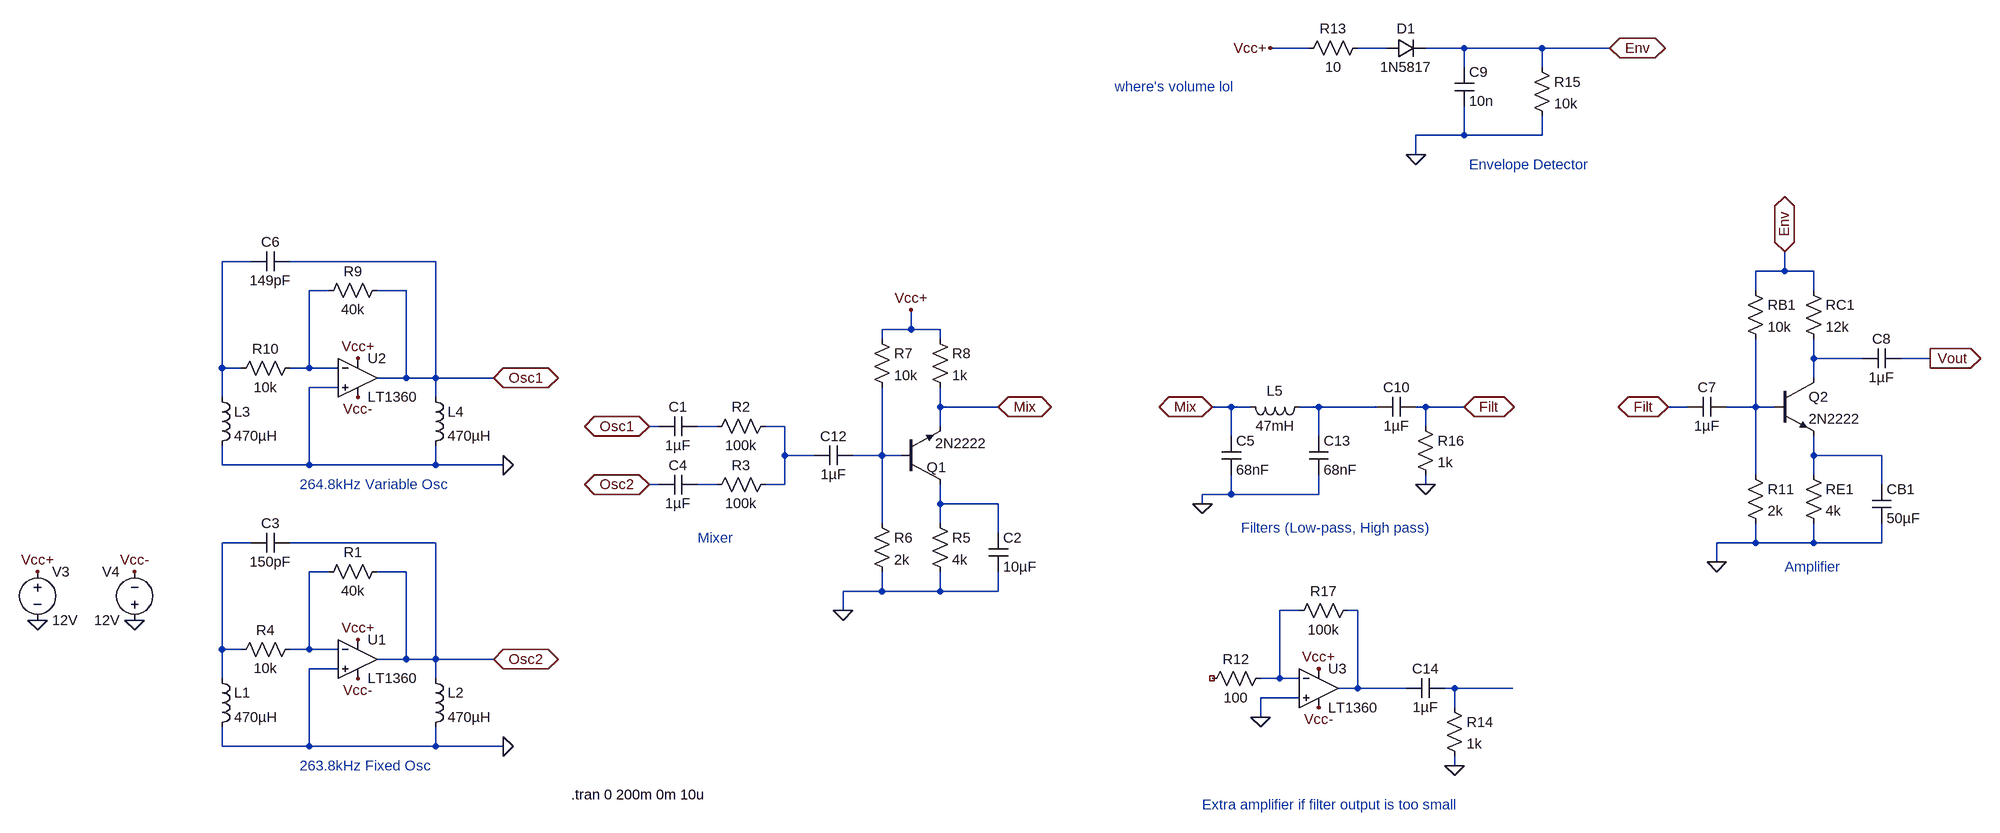
[diagram p0: schematic NoVolumeControl-V1.asc]
NoVolumeControl-V1.asc, the LTspice schematic file:
Version 4.1
SHEET 1 1940 1044
WIRE 192 -912 128 -912
WIRE 320 -912 272 -912
WIRE 448 -912 384 -912
WIRE 576 -912 448 -912
WIRE 688 -912 576 -912
WIRE 448 -880 448 -912
WIRE 576 -880 576 -912
WIRE 448 -768 448 -816
WIRE 448 -768 368 -768
WIRE 576 -768 576 -800
WIRE 576 -768 448 -768
WIRE 368 -736 368 -768
WIRE -1552 -560 -1600 -560
WIRE -1248 -560 -1488 -560
WIRE 976 -544 976 -576
WIRE 976 -544 928 -544
WIRE 1024 -544 976 -544
WIRE -1424 -512 -1456 -512
WIRE -1296 -512 -1344 -512
WIRE 928 -512 928 -544
WIRE 1024 -512 1024 -544
WIRE -464 -448 -464 -480
WIRE -464 -448 -512 -448
WIRE -416 -448 -464 -448
WIRE -512 -432 -512 -448
WIRE -416 -432 -416 -448
WIRE 1024 -400 1024 -432
WIRE 1104 -400 1024 -400
WIRE 1216 -400 1168 -400
WIRE -1600 -384 -1600 -560
WIRE -1568 -384 -1600 -384
WIRE -1456 -384 -1456 -512
WIRE -1456 -384 -1488 -384
WIRE -1408 -384 -1456 -384
WIRE -1296 -368 -1296 -512
WIRE -1296 -368 -1344 -368
WIRE -1248 -368 -1248 -560
WIRE -1248 -368 -1296 -368
WIRE -1152 -368 -1248 -368
WIRE 1024 -368 1024 -400
WIRE -1408 -352 -1456 -352
WIRE -1600 -336 -1600 -384
WIRE -1248 -336 -1248 -368
WIRE -416 -320 -416 -352
WIRE -320 -320 -416 -320
WIRE 64 -320 32 -320
WIRE 96 -320 64 -320
WIRE 208 -320 176 -320
WIRE 304 -320 208 -320
WIRE 384 -320 368 -320
WIRE 448 -320 384 -320
WIRE 816 -320 784 -320
WIRE 928 -320 928 -432
WIRE 928 -320 880 -320
WIRE 960 -320 928 -320
WIRE -880 -288 -896 -288
WIRE -784 -288 -816 -288
WIRE -672 -288 -704 -288
WIRE -416 -288 -416 -320
WIRE 384 -288 384 -320
WIRE 64 -272 64 -320
WIRE 208 -272 208 -320
WIRE -672 -240 -672 -288
WIRE -624 -240 -672 -240
WIRE -512 -240 -512 -352
WIRE -512 -240 -560 -240
WIRE -480 -240 -512 -240
WIRE 1024 -240 1024 -272
WIRE 1136 -240 1024 -240
WIRE -1600 -224 -1600 -256
WIRE -1456 -224 -1456 -352
WIRE -1456 -224 -1600 -224
WIRE -1248 -224 -1248 -256
WIRE -1248 -224 -1456 -224
WIRE -1136 -224 -1248 -224
WIRE 928 -208 928 -320
WIRE 1024 -208 1024 -240
WIRE -880 -192 -896 -192
WIRE -784 -192 -816 -192
WIRE -672 -192 -672 -240
WIRE -672 -192 -704 -192
WIRE 384 -192 384 -208
WIRE 1136 -192 1136 -240
WIRE 64 -176 64 -208
WIRE 64 -176 16 -176
WIRE 208 -176 208 -208
WIRE 208 -176 64 -176
WIRE -416 -160 -416 -192
WIRE -320 -160 -416 -160
WIRE 16 -160 16 -176
WIRE -512 -128 -512 -240
WIRE -416 -128 -416 -160
WIRE -320 -112 -320 -160
WIRE -1552 -96 -1600 -96
WIRE -1248 -96 -1488 -96
WIRE 928 -96 928 -128
WIRE 928 -96 864 -96
WIRE 1024 -96 1024 -128
WIRE 1024 -96 928 -96
WIRE 1136 -96 1136 -128
WIRE 1136 -96 1024 -96
WIRE 864 -64 864 -96
WIRE -1424 -48 -1456 -48
WIRE -1296 -48 -1344 -48
WIRE -512 -16 -512 -48
WIRE -512 -16 -576 -16
WIRE -416 -16 -416 -48
WIRE -416 -16 -512 -16
WIRE -320 -16 -320 -48
WIRE -320 -16 -416 -16
WIRE -576 16 -576 -16
WIRE 176 16 144 16
WIRE 272 16 256 16
WIRE -1600 80 -1600 -96
WIRE -1568 80 -1600 80
WIRE -1456 80 -1456 -48
WIRE -1456 80 -1488 80
WIRE -1408 80 -1456 80
WIRE -1296 96 -1296 -48
WIRE -1296 96 -1344 96
WIRE -1248 96 -1248 -96
WIRE -1248 96 -1296 96
WIRE -1152 96 -1248 96
WIRE -1408 112 -1456 112
WIRE -1600 128 -1600 80
WIRE -1248 128 -1248 96
WIRE 144 128 144 16
WIRE 144 128 112 128
WIRE 176 128 144 128
WIRE 272 144 272 16
WIRE 272 144 240 144
WIRE 352 144 272 144
WIRE 432 144 416 144
WIRE 528 144 432 144
WIRE 176 160 112 160
WIRE 432 176 432 144
WIRE 112 192 112 160
WIRE -1600 240 -1600 208
WIRE -1456 240 -1456 112
WIRE -1456 240 -1600 240
WIRE -1248 240 -1248 208
WIRE -1248 240 -1456 240
WIRE -1136 240 -1248 240
WIRE 432 272 432 256
FLAG -1136 240 0
FLAG -1904 32 0
FLAG -1744 32 0
FLAG -1904 -48 Vcc+
FLAG -1744 -48 Vcc-
FLAG -1376 64 Vcc+
FLAG -1376 128 Vcc-
FLAG -896 -288 Osc1
IOPIN -896 -288 BiDir
FLAG -896 -192 Osc2
IOPIN -896 -192 BiDir
FLAG -1152 96 Osc2
IOPIN -1152 96 BiDir
FLAG -1136 -224 0
FLAG -1376 -400 Vcc+
FLAG -1376 -336 Vcc-
FLAG -1152 -368 Osc1
IOPIN -1152 -368 BiDir
FLAG 976 -576 Env
IOPIN 976 -576 BiDir
FLAG 1216 -400 Vout
IOPIN 1216 -400 Out
FLAG -464 -480 Vcc+
FLAG -320 -320 Mix
IOPIN -320 -320 BiDir
FLAG 32 -320 Mix
IOPIN 32 -320 BiDir
FLAG 16 -160 0
FLAG 208 112 Vcc+
FLAG 208 176 Vcc-
FLAG 112 192 0
FLAG 432 272 0
FLAG 448 -320 Filt
IOPIN 448 -320 BiDir
FLAG 864 -64 0
FLAG 368 -736 0
FLAG 688 -912 Env
IOPIN 688 -912 BiDir
FLAG 384 -192 0
FLAG 784 -320 Filt
IOPIN 784 -320 BiDir
FLAG 128 -912 Vcc+
FLAG -576 16 0
SYMBOL cap -816 -304 R90
WINDOW 0 0 32 VBottom 2
WINDOW 3 32 32 VTop 2
SYMATTR InstName C1
SYMATTR Value 1µF
SYMBOL cap -816 -208 R90
WINDOW 0 0 32 VBottom 2
WINDOW 3 32 32 VTop 2
SYMATTR InstName C4
SYMATTR Value 1µF
SYMBOL res -688 -304 R90
WINDOW 0 0 56 VBottom 2
WINDOW 3 32 56 VTop 2
SYMATTR InstName R2
SYMATTR Value 100k
SYMBOL res -688 -208 R90
WINDOW 0 0 56 VBottom 2
WINDOW 3 32 56 VTop 2
SYMATTR InstName R3
SYMATTR Value 100k
SYMBOL res -1328 -64 R90
WINDOW 0 0 56 VBottom 2
WINDOW 3 32 56 VTop 2
SYMATTR InstName R1
SYMATTR Value 40k
SYMBOL res -1472 64 R90
WINDOW 0 0 56 VBottom 2
WINDOW 3 32 56 VTop 2
SYMATTR InstName R4
SYMATTR Value 10k
SYMBOL ind -1616 112 R0
SYMATTR InstName L1
SYMATTR Value 470µH
SYMATTR SpiceLine Rser=1m
SYMBOL ind -1264 112 R0
SYMATTR InstName L2
SYMATTR Value 470µH
SYMATTR SpiceLine Rser=1m
SYMBOL cap -1488 -112 R90
WINDOW 0 0 32 VBottom 2
WINDOW 3 32 32 VTop 2
SYMATTR InstName C3
SYMATTR Value 150pF
SYMBOL OpAmps\\LT1360 -1376 96 R0
SYMATTR InstName U1
SYMBOL voltage -1904 -64 R0
WINDOW 123 0 0 Left 0
WINDOW 39 0 0 Left 0
SYMATTR InstName V3
SYMATTR Value 12V
SYMBOL voltage -1744 48 R180
WINDOW 0 24 96 Left 2
WINDOW 3 24 16 Left 2
WINDOW 123 0 0 Left 0
WINDOW 39 0 0 Left 0
SYMATTR InstName V4
SYMATTR Value 12V
SYMBOL res -1328 -528 R90
WINDOW 0 0 56 VBottom 2
WINDOW 3 32 56 VTop 2
SYMATTR InstName R9
SYMATTR Value 40k
SYMBOL res -1472 -400 R90
WINDOW 0 0 56 VBottom 2
WINDOW 3 32 56 VTop 2
SYMATTR InstName R10
SYMATTR Value 10k
SYMBOL ind -1616 -352 R0
SYMATTR InstName L3
SYMATTR Value 470µH
SYMATTR SpiceLine Rser=1m
SYMBOL ind -1264 -352 R0
SYMATTR InstName L4
SYMATTR Value 470µH
SYMATTR SpiceLine Rser=1m
SYMBOL cap -1488 -576 R90
WINDOW 0 0 32 VBottom 2
WINDOW 3 32 32 VTop 2
SYMATTR InstName C6
SYMATTR Value 149pF
SYMBOL OpAmps\\LT1360 -1376 -368 R0
SYMATTR InstName U2
SYMBOL npn 960 -368 R0
SYMATTR InstName Q2
SYMATTR Value 2N2222
SYMBOL res 1008 -224 R0
SYMATTR InstName RE1
SYMATTR Value 4k
SYMBOL res 912 -224 R0
SYMATTR InstName R11
SYMATTR Value 2k
SYMBOL res 912 -528 R0
SYMATTR InstName RB1
SYMATTR Value 10k
SYMBOL cap 1120 -192 R0
SYMATTR InstName CB1
SYMATTR Value 50µF
SYMBOL cap 1168 -416 R90
WINDOW 0 0 32 VBottom 2
WINDOW 3 32 32 VTop 2
SYMATTR InstName C8
SYMATTR Value 1µF
SYMBOL res 1008 -528 R0
SYMATTR InstName RC1
SYMATTR Value 12k
SYMBOL npn -480 -192 M180
WINDOW 0 42 28 Left 2
SYMATTR InstName Q1
SYMATTR Value 2N2222
SYMBOL res -432 -144 R0
SYMATTR InstName R5
SYMATTR Value 4k
SYMBOL cap -336 -112 R0
SYMATTR InstName C2
SYMATTR Value 10µF
SYMBOL res -528 -144 R0
SYMATTR InstName R6
SYMATTR Value 2k
SYMBOL res -528 -448 R0
SYMATTR InstName R7
SYMATTR Value 10k
SYMBOL res -432 -448 R0
SYMATTR InstName R8
SYMATTR Value 1k
SYMBOL cap -560 -256 R90
WINDOW 0 0 32 VBottom 2
WINDOW 3 32 32 VTop 2
SYMATTR InstName C12
SYMATTR Value 1µF
SYMBOL ind 192 -336 R90
WINDOW 0 5 56 VBottom 2
WINDOW 3 32 56 VTop 2
SYMATTR InstName L5
SYMATTR Value 47mH
SYMATTR SpiceLine Rser=1m
SYMBOL cap 48 -272 R0
SYMATTR InstName C5
SYMATTR Value 68nF
SYMBOL cap 192 -272 R0
SYMATTR InstName C13
SYMATTR Value 68nF
SYMBOL res 128 112 R90
WINDOW 0 0 56 VBottom 2
WINDOW 3 32 56 VTop 2
SYMATTR InstName R12
SYMATTR Value 100
SYMBOL OpAmps\\LT1360 208 144 R0
SYMATTR InstName U3
SYMBOL res 272 0 R90
WINDOW 0 0 56 VBottom 2
WINDOW 3 32 56 VTop 2
SYMATTR InstName R17
SYMATTR Value 100k
SYMBOL cap 416 128 R90
WINDOW 0 0 32 VBottom 2
WINDOW 3 32 32 VTop 2
SYMATTR InstName C14
SYMATTR Value 1µF
SYMBOL res 416 160 R0
SYMATTR InstName R14
SYMATTR Value 1k
SYMBOL res 288 -928 R90
WINDOW 0 0 56 VBottom 2
WINDOW 3 32 56 VTop 2
SYMATTR InstName R13
SYMATTR Value 10
SYMBOL diode 320 -896 R270
WINDOW 0 32 32 VTop 2
WINDOW 3 0 32 VBottom 2
SYMATTR InstName D1
SYMATTR Value 1N5817
SYMBOL cap 432 -880 R0
SYMATTR InstName C9
SYMATTR Value 10n
SYMBOL res 560 -896 R0
SYMATTR InstName R15
SYMATTR Value 10k
SYMBOL cap 368 -336 R90
WINDOW 0 0 32 VBottom 2
WINDOW 3 32 32 VTop 2
SYMATTR InstName C10
SYMATTR Value 1µF
SYMBOL res 368 -304 R0
SYMATTR InstName R16
SYMATTR Value 1k
SYMBOL cap 880 -336 R90
WINDOW 0 0 32 VBottom 2
WINDOW 3 32 32 VTop 2
SYMATTR InstName C7
SYMATTR Value 1µF
TEXT -1024 320 Left 2 !.tran 0 200m 0m 10u
TEXT -1472 272 Left 2 ;263.8kHz Fixed Osc
TEXT -1472 -192 Left 2 ;264.8kHz Variable Osc
TEXT -816 -104 Left 2 ;Mixer
TEXT 80 -120 Left 2 ;Filters (Low-pass, High pass)
TEXT 456 -720 Left 2 ;Envelope Detector
TEXT 976 -56 Left 2 ;Amplifier
TEXT 16 336 Left 2 ;Extra amplifier if filter output is too small
TEXT -128 -848 Left 2 ;where's volume lol

The netlist it stands for:
* NoVolumeControl-V1.asc
C1 N007 Osc1 1µF
C4 N011 Osc2 1µF
R2 N008 N007 100k
R3 N008 N011 100k
R1 Osc2 N014 40k
R4 N014 N013 10k
L1 N013 0 470µH Rser=1m
L2 Osc2 0 470µH Rser=1m
C3 Osc2 N013 150pF
* U1: LT1360 (symbol OpAmps\LT1360 not available, pins judged from their places): In+=0 In-=N014 V+=Vcc+ V-=Vcc- OUT=Osc2
V3 Vcc+ 0 12V
V4 0 Vcc- 12V
R9 Osc1 N003 40k
R10 N003 N002 10k
L3 N002 0 470µH Rser=1m
L4 Osc1 0 470µH Rser=1m
C6 Osc1 N002 149pF
* U2: LT1360 (symbol OpAmps\LT1360 not available, pins judged from their places): In+=0 In-=N003 V+=Vcc+ V-=Vcc- OUT=Osc1
Q2 N004 N006 N010 0 2N2222
RE1 N010 0 4k
R11 N006 0 2k
RB1 Env N006 10k
CB1 N010 0 50µF
C8 Vout N004 1µF
RC1 Env N004 12k
Q1 N012 N009 Mix 0 2N2222
R5 N012 0 4k
C2 N012 0 10µF
R6 N009 0 2k
R7 Vcc+ N009 10k
R8 Vcc+ Mix 1k
C12 N009 N008 1µF
L5 N005 Mix 47mH Rser=1m
C5 Mix 0 68nF
C13 N005 0 68nF
R12 N015 NC_01 100
* U3: LT1360 (symbol OpAmps\LT1360 not available, pins judged from their places): In+=0 In-=N015 V+=Vcc+ V-=Vcc- OUT=N016
R17 N016 N015 100k
C14 N017 N016 1µF
R14 N017 0 1k
R13 N001 Vcc+ 10
D1 N001 Env 1N5817
C9 Env 0 10n
R15 Env 0 10k
C10 Filt N005 1µF
R16 Filt 0 1k
C7 N006 Filt 1µF
.model D D
.lib standard.dio
.model NPN NPN
.model PNP PNP
.lib standard.bjt
.tran 0 200m 0m 10u
* 263.8kHz Fixed Osc
* 264.8kHz Variable Osc
* Mixer
* Filters (Low-pass, High pass)
* Envelope Detector
* Amplifier
* Extra amplifier if filter output is too small
* where's volume lol
.backanno
.end